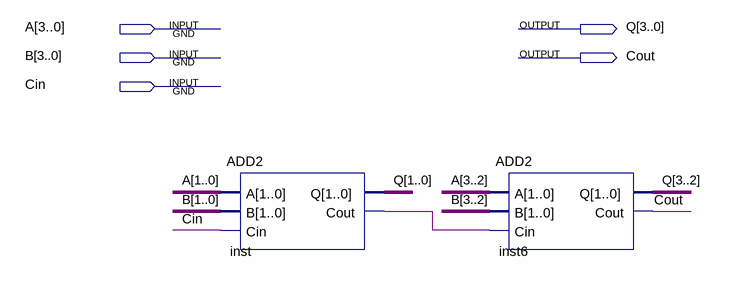
[diagram p0: schematic sheet]
// Quartus schematic ADD4.bdf as structural Verilog: 2 symbols, 5 pins
module ADD4 (
  input  [3:0] A,
  input  [3:0] B,
  input  Cin,
  output [3:0] Q,
  output Cout
);

  wire inst_cout;

  ADD2 inst (.A(A[1:0]), .B(B[1:0]), .Cin(Cin), .Q(Q[1:0]), .Cout(inst_cout));
  ADD2 inst6 (.A(A[3:2]), .B(B[3:2]), .Cin(inst_cout), .Q(Q[3:2]), .Cout(Cout));
endmodule
